# Altium project FPGYAY.PrjPcb (part 2 of 2)

## Sheet FPGA_USB.SchDoc
size A3; SheetNumber: 7; SheetTotal: 9
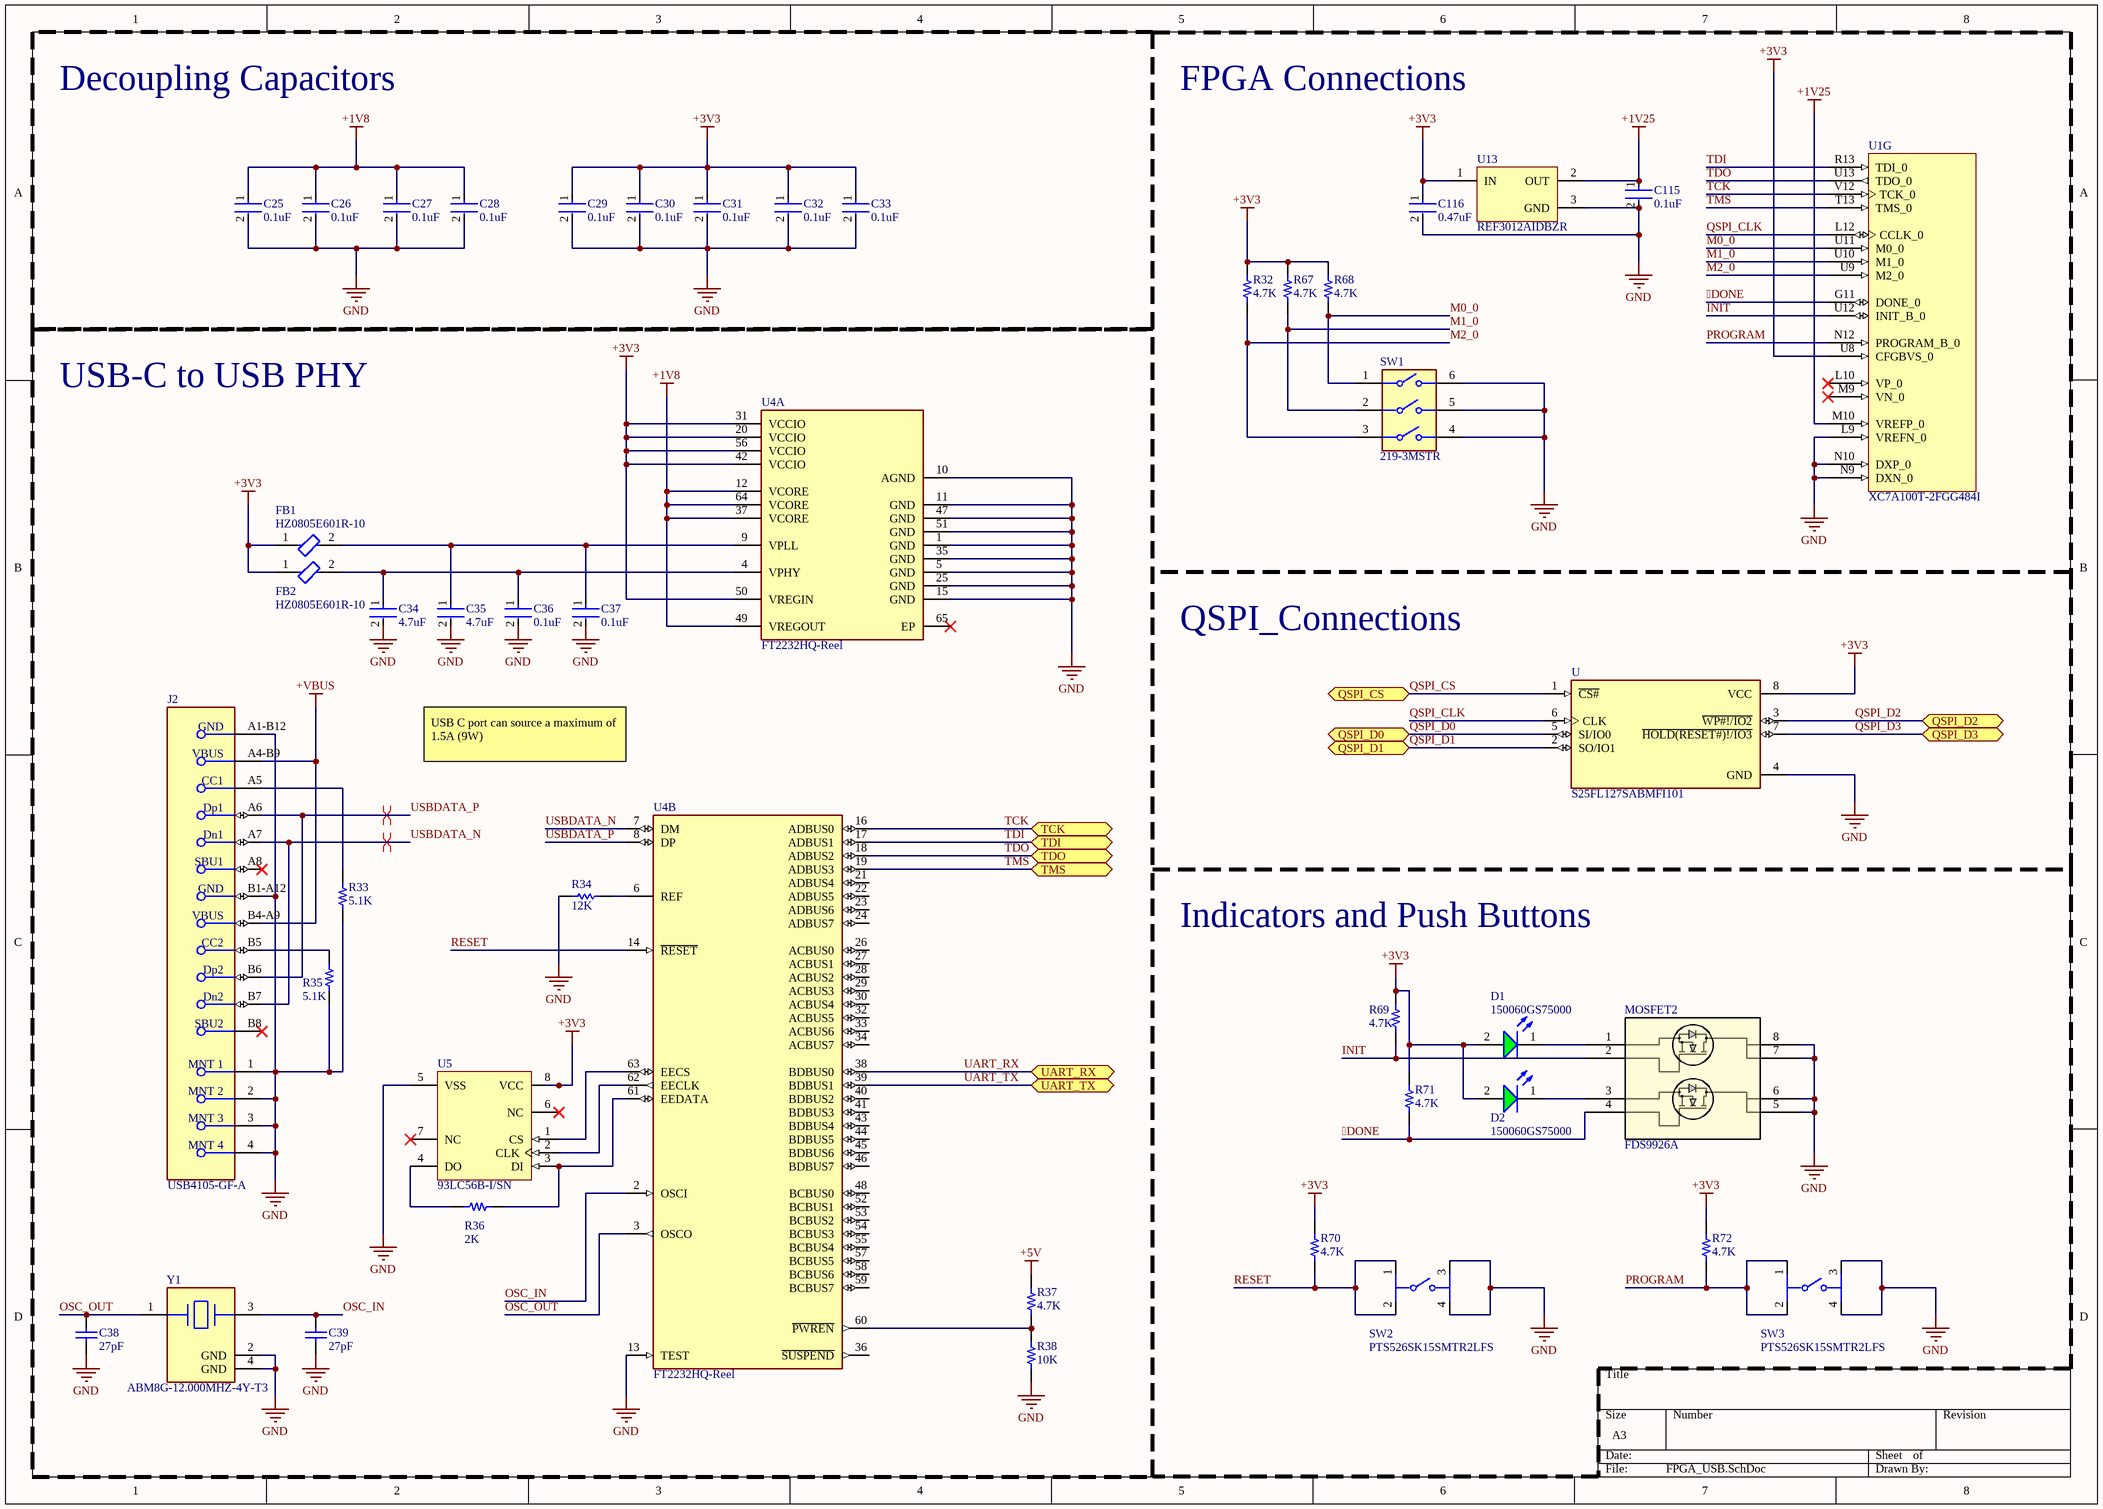
[diagram p6: FPGA_USB.SchDoc]

### Parts
C25  0.1uF  [FP-CC0402-MFG]
C26  0.1uF  [FP-CC0402-MFG]
C27  0.1uF  [FP-CC0402-MFG]
C28  0.1uF  [FP-CC0402-MFG]
C29  0.1uF  [FP-CC0402-MFG]
C30  0.1uF  [FP-CC0402-MFG]
C31  0.1uF  [FP-CC0402-MFG]
C32  0.1uF  [FP-CC0402-MFG]
C33  0.1uF  [FP-CC0402-MFG]
C34  4.7uF  [FP-CC0402-MFG]
C35  4.7uF  [FP-CC0402-MFG]
C36  0.1uF  [FP-CC0402-MFG]
C37  0.1uF  [FP-CC0402-MFG]
C38  27pF  [CAPC1005X55X25LL05T10]
C39  27pF  [CAPC1005X55X25LL05T10]
C115  0.1uF  [FP-CC0402-MFG]
C116  0.47uF  [FP-GRM188-0_1-e0_2_0_5-MFG]
D1  150060GS75000  [WL-SMCW_0603_150060xx75000]
D2  150060GS75000  [WL-SMCW_0603_150060xx75000]
FB1  HZ0805E601R-10  [FP-HZ0805-MFG]
FB2  HZ0805E601R-10  [FP-HZ0805-MFG]
J2  USB4105-GF-A  [FP-USB4105-GF-A-MFG]
MOSFET2  FDS9926A  [SOIC8_751EB_ONS-M]
R32  4.7K  [RES 0603_1608]
R33  5.1K  [RES 0603_1608]
R34  12K  [RESC1608X55X25NL10T15]
R35  5.1K  [RES 0603_1608]
R36  2K  [RES 0603_1608]
R37  4.7K  [RES 0603_1608]
R38  10K  [RES 0603_1608]
R67  4.7K  [RES 0603_1608]
R68  4.7K  [RES 0603_1608]
R69  4.7K  [RES 0603_1608]
R70  4.7K  [RES 0603_1608]
R71  4.7K  [RES 0603_1608]
R72  4.7K  [RES 0603_1608]
SW1  219-3MSTR  [FP-219-3MSTR-MFG]
SW2  PTS526SK15SMTR2LFS  [FP-PTS526SK15SMTR2LFS-MFG]
SW3  PTS526SK15SMTR2LFS  [FP-PTS526SK15SMTR2LFS-MFG]
U  S25FL127SABMFI101  [SOIC127P800X216-8N]
U1  XC7A100T-2FGG484I  [FGG484]  (part G of 10)
U4  FT2232HQ-Reel  [FP-FT2232HQ-Reel-MFG]  (parts A,B of 2)
U5  93LC56B-I/SN  [SOIC-SN8_L]
U13  REF3012AIDBZR  [DBZ0003A_M]
Y1  ABM8G-12.000MHZ-4Y-T3  [FP-ABM8G-MFG]

### Blocks framed on the sheet
Decoupling Capacitors: C25-C33
USB-C to USB PHY: C34-C39 FB1 FB2 J2 R33-R38 U4 U5 Y1

### Ports
QSPI_CS (bidir), QSPI_D0 (bidir), QSPI_D1 (bidir), QSPI_D2 (bidir), QSPI_D3 (bidir), TCK (bidir), TDI (bidir), TDO (bidir), TMS (bidir), UART_RX (bidir), UART_TX (bidir)

### Nets
+1V8: C25.1 C26.1 C27.1 C28.1 U4.12(VCORE) U4.37(VCORE) U4.49(VREGOUT) U4.64(VCORE)
+1V25: C115.1 U1.M10(VREFP_0) U13.2(OUT)
+3V3: C29.1 C30.1 C31.1 C32.1 C33.1 C116.1 D1.2(A) D2.2(A) FB1.1 FB2.1 R32.2 R67.1 R68.1 R69.1 R70.1 R71.1 R72.1 U.8(VCC) U1.U8(CFGBVS_0) U4.20(VCCIO) U4.31(VCCIO) U4.42(VCCIO) U4.50(VREGIN) U4.56(VCCIO) U5.8(VCC) U13.1(IN)
+5V: R37.1
+VBUS: J2.A4-B9(VBUS) J2.B4-A9(VBUS)
GND: C25.2 C26.2 C27.2 C28.2 C29.2 C30.2 C31.2 C32.2 C33.2 C34.2 C35.2 C36.2 C37.2 C38.2 C39.2 C115.2 C116.2 J2.1(MNT_1) J2.2(MNT_2) J2.3(MNT_3) J2.4(MNT_4) J2.A1-B12(GND) J2.B1-A12(GND) MOSFET2.5 MOSFET2.6 MOSFET2.7 MOSFET2.8 R33.2 R34.1 R35.2 R38.2 SW1.4 SW1.5 SW1.6 SW2.3 SW2.4 SW3.3 SW3.4 U.4(GND) U1.L9(VREFN_0) U1.N9(DXN_0) U1.N10(DXP_0) U4.1(GND) U4.5(GND) U4.10(AGND) U4.11(GND) U4.13(TEST) U4.15(GND) U4.25(GND) U4.35(GND) U4.47(GND) U4.51(GND) U5.5(VSS) U13.3(GND) Y1.2(GND) Y1.4(GND)
DONE: MOSFET2.4 R71.2 U1.G11(DONE_0)
\: J2.A6(Dp1) J2.B6(Dp2) U4.8(DP)  [also labelled USBDATA_P]
INIT: MOSFET2.2 R69.2 U1.U12(INIT_B_0)
M0_0: R68.2 SW1.1 U1.U11(M0_0)
M1_0: R67.2 SW1.2 U1.U10(M1_0)
M2_0: R32.1 SW1.3 U1.U9(M2_0)
OSC_IN: C39.1 U4.2(OSCI) Y1.3
OSC_OUT: C38.1 U4.3(OSCO) Y1.1
PROGRAM: R72.2 SW3.1 SW3.2 U1.N12(PROGRAM_B_0)
QSPI_CLK: U.6(CLK) U1.L12(CCLK_0)
QSPI_CS: U.1(~{CS#}) ; port QSPI_CS
QSPI_D0: U.5(SI/IO0) ; port QSPI_D0
QSPI_D1: U.2(SO/IO1) ; port QSPI_D1
QSPI_D2: U.3(~{WP#!/IO2}) ; port QSPI_D2
QSPI_D3: U.7(~{HOLD(RESET#)!/IO3}) ; port QSPI_D3
RESET: R70.2 SW2.1 SW2.2 U4.14(~{RESET})
TCK: U1.V12(TCK_0) U4.16(ADBUS0) ; port TCK
TDI: U1.R13(TDI_0) U4.17(ADBUS1) ; port TDI
TDO: U1.U13(TDO_0) U4.18(ADBUS2) ; port TDO
TMS: U1.T13(TMS_0) U4.19(ADBUS3) ; port TMS
UART_RX: U4.38(BDBUS0) ; port UART_RX
UART_TX: U4.39(BDBUS1) ; port UART_TX
USBDATA_N: J2.A7(Dn1) J2.B7(Dn2) U4.7(DM)
NetC34_1: C34.1 C36.1 FB2.2 U4.4(VPHY)
NetC35_1: C35.1 C37.1 FB1.2 U4.9(VPLL)
NetD1_1: D1.1(K) MOSFET2.1
NetD2_1: D2.1(K) MOSFET2.3
NetJ2_A5: J2.A5(CC1) R33.1
NetJ2_B5: J2.B5(CC2) R35.1
NetR34_2: R34.2 U4.6(REF)
NetR36_1: R36.1 U5.4(DO)
NetR36_2: R36.2 U4.61(EEDATA) U5.3(DI)
NetR37_2: R37.2 R38.1 U4.60(~{PWREN})
NetU4_62: U4.62(EECLK) U5.2(CLK)
NetU4_63: U4.63(EECS) U5.1(CS)

Not connected (* = marked no-connect by the designer): J2 A8(SBU1)* B8(SBU2)*; U1 L10(VP_0)* M9(VN_0)*; U4 21(ADBUS4) 22(ADBUS5) 23(ADBUS6) 24(ADBUS7) 26(ACBUS0) 27(ACBUS1) 28(ACBUS2) 29(ACBUS3) 30(ACBUS4) 32(ACBUS5) 33(ACBUS6) 34(ACBUS7) 36(~{SUSPEND}) 40(BDBUS2) 41(BDBUS3) 43(BDBUS4) 44(BDBUS5) 45(BDBUS6) 46(BDBUS7) 48(BCBUS0) 52(BCBUS1) 53(BCBUS2) 54(BCBUS3) 55(BCBUS4) 57(BCBUS5) 58(BCBUS6) 59(BCBUS7) 65(EP)*; U5 6(NC)* 7(NC)*

### Layout directives
differential pair: \, USBDATA_N

### Notes on the sheet
- FPGA Connections
- QSPI_Connections
- USB C port can source a maximum of 1.5A (9W)
- Indicators and Push Buttons

### Library data of the parts
C25-C33 C36 C37 C115 = CMP-03422-000048-1: as C21 on sheet FPGA_ETH; Device Class L1: Passive Components; Temperature Range Low: -55°C; Device Class L3: Ceramic Capacitors; Temperature Characteristic: X7R; Ipc Land Pattern Name: CAPC10050X50; Temperature Range High: +125°C; Voltage Rating: 16 V; Temperature: -55°C to +125°C; RoHS: TRUE; Automotive: No; Height: 0.55mm; Device Class L2: Capacitors; Digikey Description: CAP CER 0.1UF 16V X7R 0402; Package: CC0402; Footprint Url: http://www.yageo.com/exep/pages/download/literatures/UPY-C_GEN_24.pdf; ComponentLink2Description: Datasheet; Category: Cap; Lead Free: Yes; Octopart: https://octopart.com/cc0402krx7r7bb104-yageo-42244624; ComponentLink2URL: http://www.yageo.com/documents/recent/UPY-GP_NP0_16V-to-50V_16.pdf; Mouser Description: 0402 0.1 uF 16 V ±10 % Tolerance X7R SMT Multilayer Ceramic Capacitor
C34 C35 = CMP-03422-001118-1: CAP CER 4.7UF 10V X5R 0402; Manufacturer Part Number: CC0402MRX5R6BB475; Manufacturer: YAGEO; Automotive Grade: NA; Tolerance: 0.2; Temperature Coefficient: 30ppm/°C; Material: Ceramic; ComponentLink2URL: http://www.yageo.com/documents/recent/UPY-GP_NP0_16V-to-50V_16.pdf; Temperature Range Low: -55°C; Digikey Description: CAP CER 4.7UF 10V X5R 0402; Category: Cap; Height: 0.55mm; Mouser Description: Multilayer Ceramic Capacitors MLCC - SMD/SMT 4.7M nF X5R 20% 10 Volts; ComponentLink2Description: Datasheet; Automotive: No; Octopart: https://octopart.com/cc0402mrx5r6bb475-yageo-57080755; Device Class L3: Ceramic Capacitors; Temperature Characteristic: X5R; Ipc Land Pattern Name: CAPC10050X50; Device Class L1: Passive Components; RoHS: TRUE; Device Class L2: Capacitors; Temperature Range High: +125°C; Voltage Rating: 10 V; Value: 4.7 uF; Footprint Url: http://www.yageo.com/exep/pages/download/literatures/UPY-C_GEN_24.pdf; Capacitance: 4.7 uF; Package: CC0402; Lead Free: Yes; Temperature: -55°C to +125°C
C38 C39 = CMP-2008-03917-1: Part Number: GRM1555C1H270JA01D; Manufacturer: Murata
C116 = CMP-06035-003857-1: Chip Multilayer Ceramic Capacitors for General Purpose, 0603, 0.47uF, X7R, 15%, 10%, 25V; Capacitance: 470nF; Voltage: 50V; Case Code (Imperial): 0603; Mount: Surface Mount; Material: Ceramic; Case/Package: 0603; Thickness: 0.035inch; Tolerance: 10%; Length: 1.6mm; Lead Free: Lead Free; Voltage Rating: 25V; Width: 0.031inch; Voltage Rating (DC): 25V; Dielectric: X7R; Case Code (Metric): 1608; Number of Pins: 2; Termination: SMD/SMT; REACH SVHC: No SVHC; Min Operating Temperature: -55°C; Max Operating Temperature: 125°C; Depth: 0.8mm; Height: 0.8mm; Package Quantity: 4000; Packaging: Tape and Reel
D1 D2 = CMP-1426-00002-3: NexarPartId: 29687084; Color: Green; Power Dissipation: 105mW; Peak Wavelength: 515nm; Viewing Angle: 140°; Test Current: 20mA; Wavelength: 520nm; Lens Style: Clear, Rectangular; Max Junction Temperature (Tj): 95°C; Luminous Intensity: 430mcd; Output Current: 10µA; Max Reverse Voltage (DC): 5V; Forward Voltage: 3.2V; Dominant Wavelength: 525nm; Forward Current: 100mA; Mount: Surface Mount; Height: 700µm; Lead Free: Lead Free; Min Operating Temperature: -40°C; Max Operating Temperature: 85°C; Length: 1.6mm; Width: 800µm; Case/Package: 0603; Case Code (Imperial): 0603; Case Code (Metric): 1608; Packaging: Tape and Reel; Reverse Voltage: 5V; REACH SVHC: Unknown; RoHS: Compliant
FB1 FB2 = CMP-2000-05194-2: FERRITE BEAD 600 OHM 0805 1LN; Current Rating: 500mA; Frequency: 100MHz; DC Resistance (DCR): 300mR; Number of Lines: 1; Impedance: 600R; Packaging: Tape and Reel; Mount: Surface Mount; Package Quantity: 1; Material: Ferrite; Width: 0.049inch; Min Operating Temperature: -40°C; Core Material: Ferrite; Max Current Rating: 500mA; Case Code (Metric): 2012; Depth: 1.45mm; Case Code (Imperial): 0805; Termination: SMD/SMT; Contact Plating: Tin; Lead Free: Lead Free; Weight: 0.00392oz; Case/Package: 0805; Test Frequency: 100MHz; Length: 2mm; Height: 1.25mm; Max Operating Temperature: 125°C; Max DC Current: 500mA
J2 = CMP-245163-000001-1: CONN RCPT USB2.0 TYPEC 5A; Manufacturer: GCT; Voltage Rating: 20V; Is Female: yes; Current Rating: 5/6.25/1.25/0.25A; Number Of Contacts: 16; Conn Orientation: Right Angle; Device Class L1: Connectors; Category: Conn; Lead Free: Yes; RoHS: TRUE; Temperature Range High: +85°C; Digikey Description: CONN RCPT USB2.0 TYPEC 5A; Device Class L3: unset; ComponentLink2Description: Datasheet; Manufacturer Part Number: USB4105-GF-A; Package: 0; Usb Standard: USB 2.0; Device Class L2: USB Connectors; Automotive: No; Temperature Range Low: -40°C; Height: 3.46mm; Temperature: -40°C to +85°C; Contact Material: Gold,Nickel; ComponentLink2URL: https://gct.co/files/drawings/usb4105.pdf; Octopart: https://octopart.com/usb4105-gf-a-gct-106627878
MOSFET2 = FDS9926A: No Description Available; Mfr_Name: onsemi; RefDes: RefDes; Type: Type
R32 R37 R67-R72 = CMP-010-0075-8: as R73 on sheet FPGA_OUTPUTS; Case/Package: 0603; Voltage Rating: 75V
R33 R35 = CMP-00051-2: 5.1 kOhms ±1% 0.1W, 1/10W Chip Resistor 0603 (1608 Metric) Automotive AEC-Q200 Thick Film; Voltage Rating: 75V; Temperature Coefficient: 100ppm/°C; Case/Package: 0603
R34 = CMP-1659-00047-2: Chip Resistor, 12 KOhm, +/- 1%, 100 mW, -55 to 155 degC, 0603 (1608 Metric), RoHS, Tape and Reel; Resistance: 12 kohm; Power Rating: 100 mW; Voltage Rating (DC): 50 V; Case\Package: 0603; ComponentLink2URL: http://www.yageo.com/documents/recent/PYu-RC_Group_51_RoHS_L_04.pdf; Case Code (Imperial): 0603; ComponentLink2Description: Datasheet; Height: 0.45 mm; Case Code (Metric): 1608; RoHSCompliant: true; Max Operating Temperature: 155 degC; Width: 0.8 mm; Mount: Surface Mount; ComponentLink1URL: http://www.yageo.com/; Pins: 2; Tolerance: 1%; Min Operating Temperature: -55 degC; Length: 1.6 mm; PackageReference: 0603; REACH SVHC: No SVHC; PackageDescription: 2-Pin Surface Mount Device, Body 1.6 x 0.8 mm; Voltage Rating: 50 V; Packaging: Tape and Reel; Package Quantity: 5000; ComponentLink1Description: Manufacturer URL; DatasheetVersion: Rev. 4, 02/2016
R36 = CMP-010-0057-8: 2k Ohm ±1% 0.1W, 1/10W Chip Resistor 0603 (1608 Metric) Moisture Resistant Thick Film; Voltage Rating: 75V; Temperature Coefficient: 100ppm/°C; Case/Package: 0603
R38 = CMP-009-00190-14: 10 ±1% 0.1W, 1/10W Chip Resistor 0603 (1608 Metric) Automotive AEC-Q200 Thick Film; Voltage Rating: 75V; Temperature Coefficient: 100ppm/°C; Case/Package: 0603
SW1 = CMP-07018-000004-1: SWITCH SLIDE DIP SPST 100MA 20V; Washable: Yes; Mechanical Life: 2000Cycles; Number of Positions: 3; Pitch: 0.1inch; Actuator Type: Slide (Standard); Max Operating Temperature: 85°C; Voltage Rating (DC): 20V; Termination: Gull Wing; Length: 0.358inch; Min Operating Temperature: -55°C; Orientation: Straight; Mount: Surface Mount; Package Quantity: 1000; Current Rating: 100mA; Electrical Life: 2000Cycles; Max Current Rating: 100mA; Throw Configuration: SPST; Contact Material: Copper; Packaging: Tape and Reel; Contact Plating: Gold; Lead Free: Lead Free; Max Voltage Rating (DC): 20V
SW2 SW3 = CMP-10040-000013-1: TACT 5.2 X 5.2, 1.5 MM H, 260GF,; Manufacturer: C&K; Operating Force: 250gf; Throw Configuration: SPST-NO; Contact Current Rating: 50mA; Standoff Height: 0mm; Contact Resistance: 100mΩ; Voltage Rating Dc: 12V; Electromechanical Life: 200000Cycles; Device Class L3: Tactile Switches; Device Class L2: Switches; Temperature: -20°C to +70°C; Temperature Range Low: -20°C; Package: PTS526SK15SMTR2LFS; Temperature Range High: +70°C; ComponentLink2Description: Datasheet; Device Class L1: Electromechanical; Height: 1.65mm; Digikey Description: TACT 5.2 X 5.2, 1.5 MM H, 260GF,; Category: Switch; RoHS: TRUE; Automotive: No; Lead Free: Yes; Manufacturer Part Number: PTS526SK15SMTR2LFS; Octopart: https://octopart.com/pts526+sk15+smtr2+lfs-c%26k+components-100617999; ComponentLink2URL: https://www.ckswitches.com/media/2780/pts526.pdf
U = S25FL127SABMFI101: FLASH - NOR Memory IC 128Mb _16M x 8_ SPI - Quad I/O 108MHz 8-SOIC; MF: Cypress Semiconductor; SnapEDA_Link: https://www.snapeda.com/parts/S25FL127SABMFI101/Teledyne%20e2v/view-part/580625/?ref=snap; Value: *; Digi-Key_Part_Number: 1274-1045-ND; Digi-Key_Purchase_URL: https://www.digikey.com/product-detail/en/cypress-semiconductor-corp/S25FL127SABMFI101/1274-1045-ND/4142071?utm_source=snapeda&utm_medium=aggregator&utm_campaign=symbol; MP: S25FL127SABMFI101; Package: SOIC-8 Cypress Semiconductor
U1 = CMP-0364-00030-3: as U1 on sheet Sheet1; ComponentLink2URL: http://www.xilinx.com/support/documentation/user_guides/ug475_7Series_Pkg_Pinout.pdf; DatasheetVersion: v1.12; PartNumber: XC7A100T-2FGG484I; ComponentLink5Description: Packaging and Pinout; PackageDescription: Wire-Bond Fine-Pitch BGA, Body 23 x 23 mm, 1.0 mm Pitch; Mounting Technology: Surface Mount; ComponentLink1Description: Datasheet; ComponentLink4URL: http://www.xilinx.com/support/packagefiles/a7packages/xc7a100tfgg484pkg.txt; PackageVersion: Rev 1.8; NexusDeviceID: XC7A100T-2FGG484I; ComponentLink5URL: http://www.xilinx.com/support/documentation/user_guides/ug475_7Series_Pkg_Pinout.pdf; Code_JEDEC: MS-034-AAJ-1; Generic Part Number: XC7A100T; ComponentLink4Description: Package File; ComponentLink3Description: DC and Switching Characteristics; ComponentLink1URL: http://www.xilinx.com/support/documentation/data_sheets/ds180_7Series_Overview.pdf; CLBs (Max Distributed RAM Kb): 1188; ComponentLink2Description: Package Specification; RoHS: Pb-Free; ComponentLink3URL: http://www.xilinx.com/support/documentation/data_sheets/ds181_Artix_7_Data_Sheet.pdf; PackageReference: FGG484
U4 = CMP-0078-00004-5: IC USB HS DUAL UART/FIFO 64-QFN; Manufacturer: FTDI; Min Supply Voltage: 1.62V; Ciiva Ids: 1315829; Nominal Supply Current: 5-70mA; Standoff Height: 0mm; Import Ts: 1521843541; Description: USB Bridge, USB to UART,FIFO USB 2.0 UART Interface 64-QFN (9x9); Number Of Ports: 1; Max Supply Voltage: 3.63V; Data Rate: 480Mbits/s; Interface: I2C,SPI,UART,USB,RS-232,RS-485,RS-422,Other; Usb Standard: USB 2.0; Octopart: https://octopart.com/ft2232hq-reel-ftdi-19172126; Ipc Land Pattern Name: QFN50P900X900X85-64; Ambient Temperature Range High: +85°C; RoHS: TRUE; Manufacturer Part Number: FT2232HQ-Reel; Automotive: No; Footprint Url: https://www.ftdichip.com/Support/Documents/TechnicalNotes/TN_166%20FTDI%20Example%20IC%20PCB%20Footprints.pdf; Temperature Range High: +85°C; ComponentLink2Description: Datasheet; Ambient Temperature Range Low: -40°C; Mouser Description: USB Interface IC USB HS to Dual UART/ FIFO/SPI/JTAG/I2C; ComponentLink2URL: https://www.ftdichip.com/Support/Documents/DataSheets/ICs/DS_FT2232H.pdf; Digikey Description: IC USB HS DUAL UART/FIFO 64-QFN; Release Date: 1383921489; Height: 0.9mm; Lead Free: Yes; Package: QFN64; Device Class L1: Integrated Circuits (ICs); Temperature: -40°C to +85°C; Temperature Range Low: -40°C; Category: IC; Device Class L2: Interface ICs; Device Class L3: USB Interface ICs
U5 = CMP-0162-00077-1: 2K, 128x16-bit, 2.5V Microwire Serial EEPROM, 8-Pin SOIC 150mil, Industrial Temperature; Code_IPC: SOIC127P600-8; PackageVersion: revBB, Aug-2009; PackageDescription: 8-Lead Plastic Small Outline (SN) - Narrow, 3.90mm Body [SOIC]; DatasheetVersion: revF, May-2008; PackageReference: SOIC-SN8; Code_JEDEC: MS-012
U13 = CMP-0367-00192-2: 1.25 V, 50 ppm / degC, 50 uA Series (Bandgap) Voltage Reference, -40 to 125 degC, 3-pin SOT-23 (DBZ), Green (RoHS & no Sb/Br); Manufacturer: Texas Instruments; VI(Min)(V): 1.8; Iq(Max)(uA): 50; Rating: Catalog; Temp Coeff(Typ)(ppm/ degree C): 20; VI(Max)(V): 5.5; SubFamily: Series Voltage Reference; VO(V): 1.25; Initial Accuracy @ 25/deg C(%): 0.2; Mounting Technology: Surface Mount; PackageDescription: 3-Pin Plastic Small Outline, Body 2.92 x 1.3 mm, Pitch 0.95 mm; PartNumber: REF3012AIDBZR; ComponentLink3Description: Package Specification; Temp Coeff(Max)(ppm/ degree C): 50; ComponentLink1URL: http://www.ti.com/; PackageVersion: 4203227/B; ComponentLink3URL: http://www.ti.com/litv/pdf/mpds108a; ComponentLink2URL: http://www.ti.com/general/docs/lit/getliterature.tsp?genericPartNumber=REF3012&fileType=pdf; Eco-Plan: Green (RoHS & no Sb/Br); ComponentLink2Description: Datasheet; Code_JEDEC: TO-236; ComponentLink1Description: Manufacturer URL; PackageReference: DBZ0003A; DatasheetVersion: SBVS032F
Y1 = CMP-27762-014577-1: Crystal 12MHz ±30ppm (Tol) ±30ppm (Stability) 10pF FUND 120Ω 4-Pin SMD T/R; ESR (Equivalent Series Resistance): 120R; Height: 0.039inch; Load Capacitance: 10pF; Operating Frequency: 12 MHz; REACH SVHC: No SVHC; Series: ABM8G; Series Resistance: 120R; Width: 0.098inch; Case/Package: CSMD; Min Operating Temperature: -10°C; Frequency: 12MHz; Mount: Surface Mount; Frequency Tolerance: 30ppm; Max Operating Temperature: 60°C; Lead Free: Lead Free; Frequency Stability: 30ppm; Depth: 2.5mm; Number of Pins: 4; Length: 3.2mm; Packaging: Tape and Reel

## Sheet FPGA_AUDIO.SchDoc
size A4; SheetNumber: 7; SheetTotal: 8
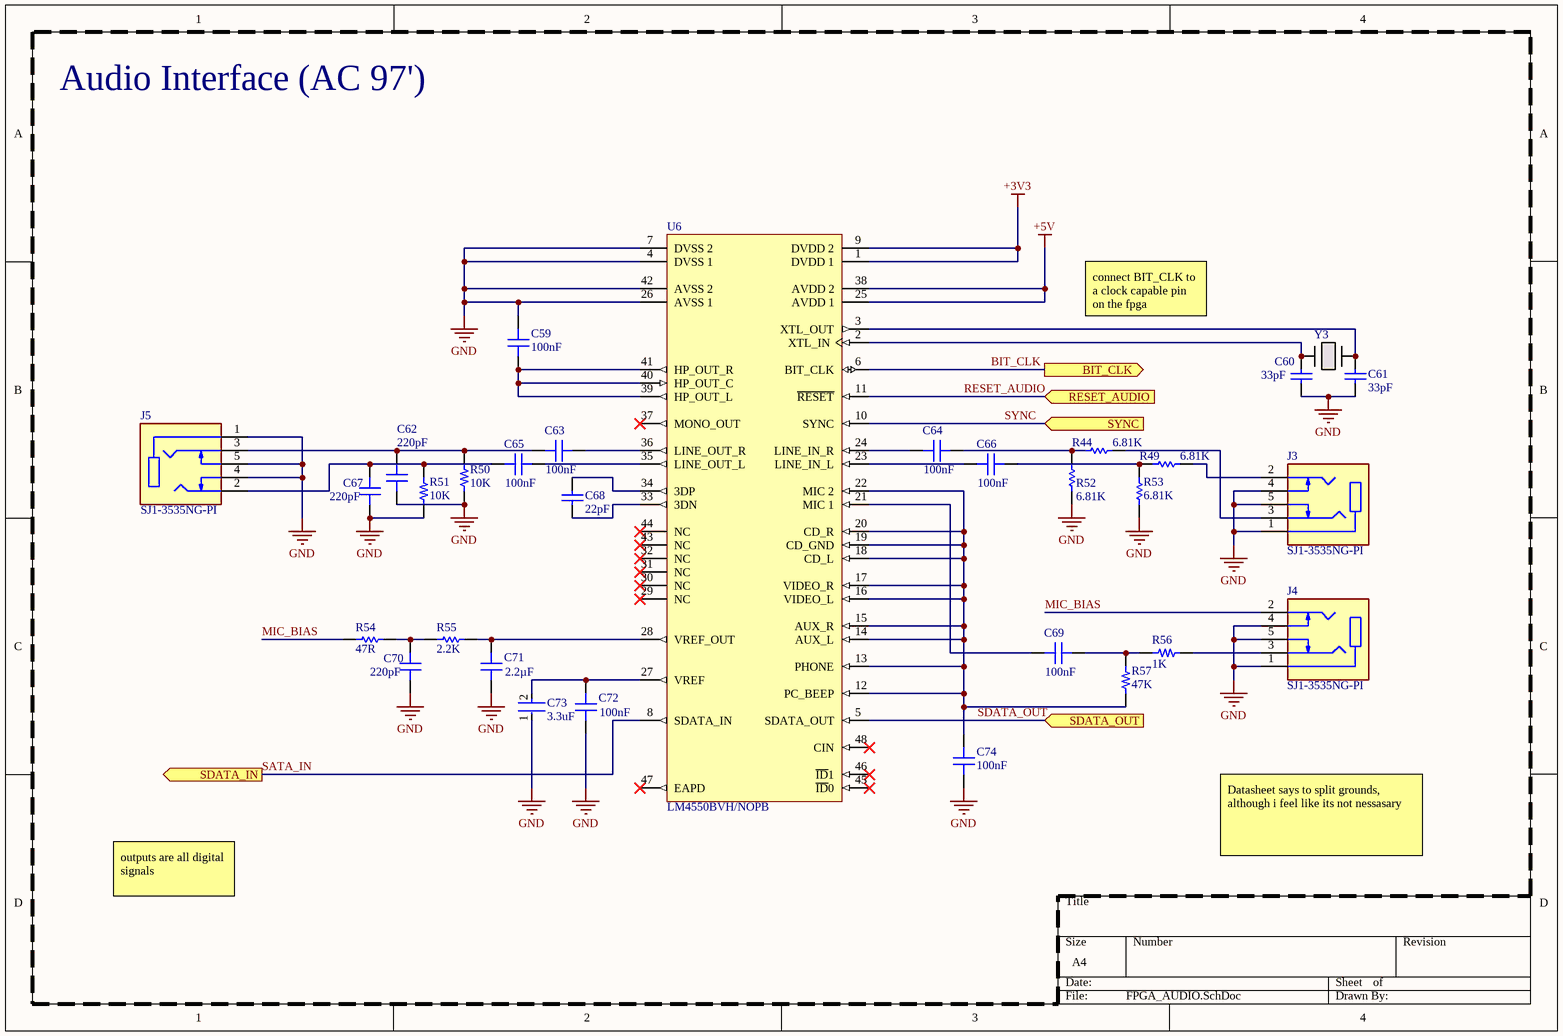
[diagram p7: FPGA_AUDIO.SchDoc]

### Parts
C59  Capacitance: 100nF  [CAP 0603_1608]  (hidden comment: CAP CER 0.1UF 100V 10% X7R 0603)
C60  33pF  [CAPC1005X55X25ML05T10]
C61  33pF  [CAPC1005X55X25ML05T10]
C62  Capacitance: 220pF  [CAP 0603_1608]  (hidden comment: CAP CER 220PF 50V 5% C0G/NP0 0603)
C63  Capacitance: 100nF  [CAP 0603_1608]  (hidden comment: CAP CER 0.1UF 100V 10% X7R 0603)
C64  Capacitance: 100nF  [CAP 0603_1608]  (hidden comment: CAP CER 0.1UF 100V 10% X7R 0603)
C65  Capacitance: 100nF  [CAP 0603_1608]  (hidden comment: CAP CER 0.1UF 100V 10% X7R 0603)
C66  Capacitance: 100nF  [CAP 0603_1608]  (hidden comment: CAP CER 0.1UF 100V 10% X7R 0603)
C67  Capacitance: 220pF  [CAP 0603_1608]  (hidden comment: CAP CER 220PF 50V 5% C0G/NP0 0603)
C68  22pF  [CAPC1005X55X25NL05T10]
C69  Capacitance: 100nF  [CAP 0603_1608]  (hidden comment: CAP CER 0.1UF 100V 10% X7R 0603)
C70  Capacitance: 220pF  [CAP 0603_1608]  (hidden comment: CAP CER 220PF 50V 5% C0G/NP0 0603)
C71  Capacitance: 2.2µF  [CAP 0603_1608]  (hidden comment: CAP CER 2.2UF 25V 10% X5R 0603)
C72  Capacitance: 100nF  [CAP 0603_1608]  (hidden comment: CAP CER 0.1UF 100V 10% X7R 0603)
C73  3.3uF  [FP-C1608-080-0_1-IPC_C]
C74  Capacitance: 100nF  [CAP 0603_1608]  (hidden comment: CAP CER 0.1UF 100V 10% X7R 0603)
J3  SJ1-3535NG-PI  [CUI_SJ1-3535NG-PI]
J4  SJ1-3535NG-PI  [CUI_SJ1-3535NG-PI]
J5  SJ1-3535NG-PI  [CUI_SJ1-3535NG-PI]
R44  6.81K  [RESC1005X40X25ML05T05]
R49  6.81K  [RESC1005X40X25ML05T05]
R50  10K  [RES 0603_1608]
R51  10K  [RES 0603_1608]
R52  6.81K  [RESC1005X40X25ML05T05]
R53  6.81K  [RESC1005X40X25ML05T05]
R54  47R  [RESC1608X55X30NL15T15]
R55  2.2K  [RESC1608X55X25LL10T15]
R56  1K  [RES 0603_1608]
R57  47K  [RES 0603_1608]
U6  LM4550BVH/NOPB  [PT0048A_L]
Y3  FOXSDLF245F-20  [CRYSTAL_HC49SDLF_FXT]  (value not drawn)

### Ports
BIT_CLK (out), RESET_AUDIO (in), SDATA_IN (out), SDATA_OUT (in), SYNC (in)

### Nets
+3V3: U6.1(DVDD_1) U6.9(DVDD_2)
+5V: U6.25(AVDD_1) U6.38(AVDD_2)
GND: C59.1 C60.2 C61.2 C62.2 C67.2 C70.2 C71.2 C72.2 C73.1 C74.2 J3.1 J3.4 J3.5 J4.1 J4.4 J4.5 J5.1 J5.4 J5.5 R50.2 R51.2 R52.1 R53.1 U6.4(DVSS_1) U6.7(DVSS_2) U6.26(AVSS_1) U6.42(AVSS_2)
BIT_CLK: U6.6(BIT_CLK) ; port BIT_CLK
MIC_BIAS: J4.2 R54.1
RESET_AUDIO: U6.11(~{RESET}) ; port RESET_AUDIO
SATA_IN: U6.8(SDATA_IN) ; port SDATA_IN
SDATA_OUT: U6.5(SDATA_OUT) ; port SDATA_OUT
SYNC: U6.10(SYNC) ; port SYNC
NetC59_2: C59.2 U6.39(HP_OUT_L) U6.40(HP_OUT_C) U6.41(HP_OUT_R)
NetC60_1: C60.1 U6.2(XTL_IN) Y3.2
NetC61_1: C61.1 U6.3(XTL_OUT) Y3.1
NetC62_1: C62.1 C63.1 J5.3 R50.1
NetC63_2: C63.2 U6.36(LINE_OUT_R)
NetC64_1: C64.1 U6.24(LINE_IN_R)
NetC64_2: C64.2 R44.1 R52.2
NetC65_1: C65.1 C67.1 J5.2 R51.1
NetC65_2: C65.2 U6.35(LINE_OUT_L)
NetC66_1: C66.1 U6.23(LINE_IN_L)
NetC66_2: C66.2 R49.1 R53.2
NetC68_1: C68.1 U6.34(3DP)
NetC68_2: C68.2 U6.33(3DN)
NetC69_1: C69.1 U6.21(MIC_1)
NetC69_2: C69.2 R56.1 R57.1
NetC70_1: C70.1 R54.2 R55.1
NetC71_1: C71.1 R55.2 U6.28(VREF_OUT)
NetC72_1: C72.1 C73.2 U6.27(VREF)
NetC74_1: C74.1 R57.2 U6.12(PC_BEEP) U6.13(PHONE) U6.14(AUX_L) U6.15(AUX_R) U6.16(VIDEO_L) U6.17(VIDEO_R) U6.18(CD_L) U6.19(CD_GND) U6.20(CD_R) U6.22(MIC_2)
NetJ3_2: J3.2 R49.2
NetJ3_3: J3.3 R44.2
NetJ4_3: J4.3 R56.2

Not connected (* = marked no-connect by the designer): U6 29(NC)* 30(NC)* 31(NC)* 32(NC)* 37(MONO_OUT)* 43(NC)* 44(NC)* 45(~{ID}0)* 46(~{ID}1)* 47(EAPD)* 48(CIN)*

### Notes on the sheet
- Audio Interface (AC 97')
- connect BIT_CLK to a clock capable pin on the fpga
- Datasheet says to split grounds, although i feel like its not nessasary
- outputs are all digital signals

### Library data of the parts
C59 C63-C66 C69 C72 C74 = CMP-013-0022-14: Ceramic Capacitor, Multilayer, Ceramic, 100V, 10% +Tol, 10% -Tol, X7R, 15% TC, 0.1uF, Surface Mount, 0603; Case/Package: 0603; Tolerance: 10%
C60 C61 = CMP-2008-03913-1: Part Number: GRM1555C1H330JA01D; Manufacturer: Murata
C62 C67 C70 = CMP-013-0101-6: 220pF ±5% 50V Ceramic Capacitor C0G, NP0 0603 (1608 Metric); Case/Package: 0603; Tolerance: 5%
C68 = CMP-2008-04302-1: Part Number: GRM1555C1H220JA01D; Manufacturer: Murata
C71 = CMP-013-0100-6: 2.2µF ±10% 25V Ceramic Capacitor X5R 0603 (1608 Metric); Tolerance: 10%; Case/Package: 0603
C73 = CMP-08246-004786-1: Multilayer Ceramic Capacitors 3.3μF ±10% 16V X5R SMD 0603; Max Operating Temperature: 85°C; Height: 0.8mm; Weight: 7.1E-05oz; Series: C; Construction: Flat; Capacitance: 3.3uF; Mount: Surface Mount; Voltage Rating (DC): 16V; Voltage Rating: 16V; Case Code (Imperial): 0603; Case Code (Metric): 1608; Min Operating Temperature: -55°C; Depth: 0.8mm; REACH SVHC: No SVHC; Package Quantity: 1; Case/Package: 0603; Tolerance: 10%; Packaging: Tape and Reel; Width: 0.031inch; RoHS Compliant: Yes; Thickness: 0.035inch; Lead Free: Lead Free; Length: 1.6mm; Dielectric Material: Ceramic; Radiation Hardening: No; Termination: SMD/SMT; Dielectric: X5R
J3-J5 = SJ1-3535NG-PI: 3.5 mm Right-Angle Stereo Jack, 5 pin PCB PCB Mount, Isolated Ground, Pink; Value: *; Availability: Unavailable; Price: None; Package: None; MP: SJ1-3535NG-PI
R44 R49 R52 R53 = CMP-2002-01038-1: Part Number: ERJ-2RKF6811X; Manufacturer: Panasonic
R50 R51 = CMP-009-00190-14: as R38 on sheet FPGA_USB; Case/Package: 0603
R54 = CMP-2000-00529-2: Chip Resistor, 47 Ohm, +/- 1%, 0.1 W, -55 to 155 degC, 0603 (1608 Metric), RoHS, Tape and Reel; Power Rating: 100 mW; Case\Package: 0603; Voltage Rating (DC): 50 V; Resistance: 6.8 kohm; Length: 1.6 mm; Case Code (Metric): 1608; Packaging: Tape and Reel; Min Operating Temperature: -55 degC; DatasheetVersion: Apr-15; PackageReference: 0603; Case Code (Imperial): 0603; PackageDescription: 2-Pin Surface Mount Device, Body 1.6 x 0.85 mm; Tolerance: 1%; Height: 0.45 mm; RoHSCompliant: true; ComponentLink2Description: Datasheet; Pins: 2; ComponentLink1URL: http://www.panasonic.com/; Package Quantity: 5000; REACH SVHC: No SVHC; ComponentLink2URL: http://industrial.panasonic.com/cdbs/www-data/pdf/RDA0000/AOA0000C86.pdf; Width: 0.8 mm; Mount: Surface Mount; Max Operating Temperature: 155 degC; ComponentLink1Description: Manufacturer URL; Voltage Rating: 50 V
R55 = CMP-2000-04211-1: Part Number: RC0603FR-132K2L; Manufacturer: Yageo
R56 = CMP-009-00014-17: 1 kOhms ±1% 0.1W, 1/10W Chip Resistor 0603 (1608 Metric) Moisture Resistant Thick Film; Temperature Coefficient: 100ppm/°C; Voltage Rating: 75V; Case/Package: 0603
R57 = CMP-010-0063-10: Fixed Resistor, Metal Glaze/thick Film, 0.1W, 47000ohm, 75V, 1% +/-Tol, 100ppm/Cel, Surface Mount, 0603; Temperature Coefficient: 100ppm/°C; Case/Package: 0603; Voltage Rating: 75V
U6 = CMP-0064-00035-3: AC '97 Rev 2.1 Codec with Sample Rate Conversion and National 3D Sound, 48-pin LQFP, Pb-Free; Manufacturer: Texas Instruments; PackageTopMarking: NSUZXYTT*LM4550*BVH; PowerWise: N; CompType: OtherParts; ComponentLink1Description: Datasheet URL; RoHS: Y; PackageDescription: LQFP, 7 x 7 x 1.4mm, 48 Lead, 0.5mm Pitch; PackageReference: PT0048A; PinCount: 48; ComponentLink1URL: http://www.ti.com/general/docs/lit/getliterature.tsp?genericPartNumber=LM4550B&fileType=pdf
Y3 = FOXSDLF245F-20: No Description Available; Mfr_Name: Fox

## Sheet FPGA_DDR3_Interface.SchDoc
size A3; SheetNumber: 9; SheetTotal: 9
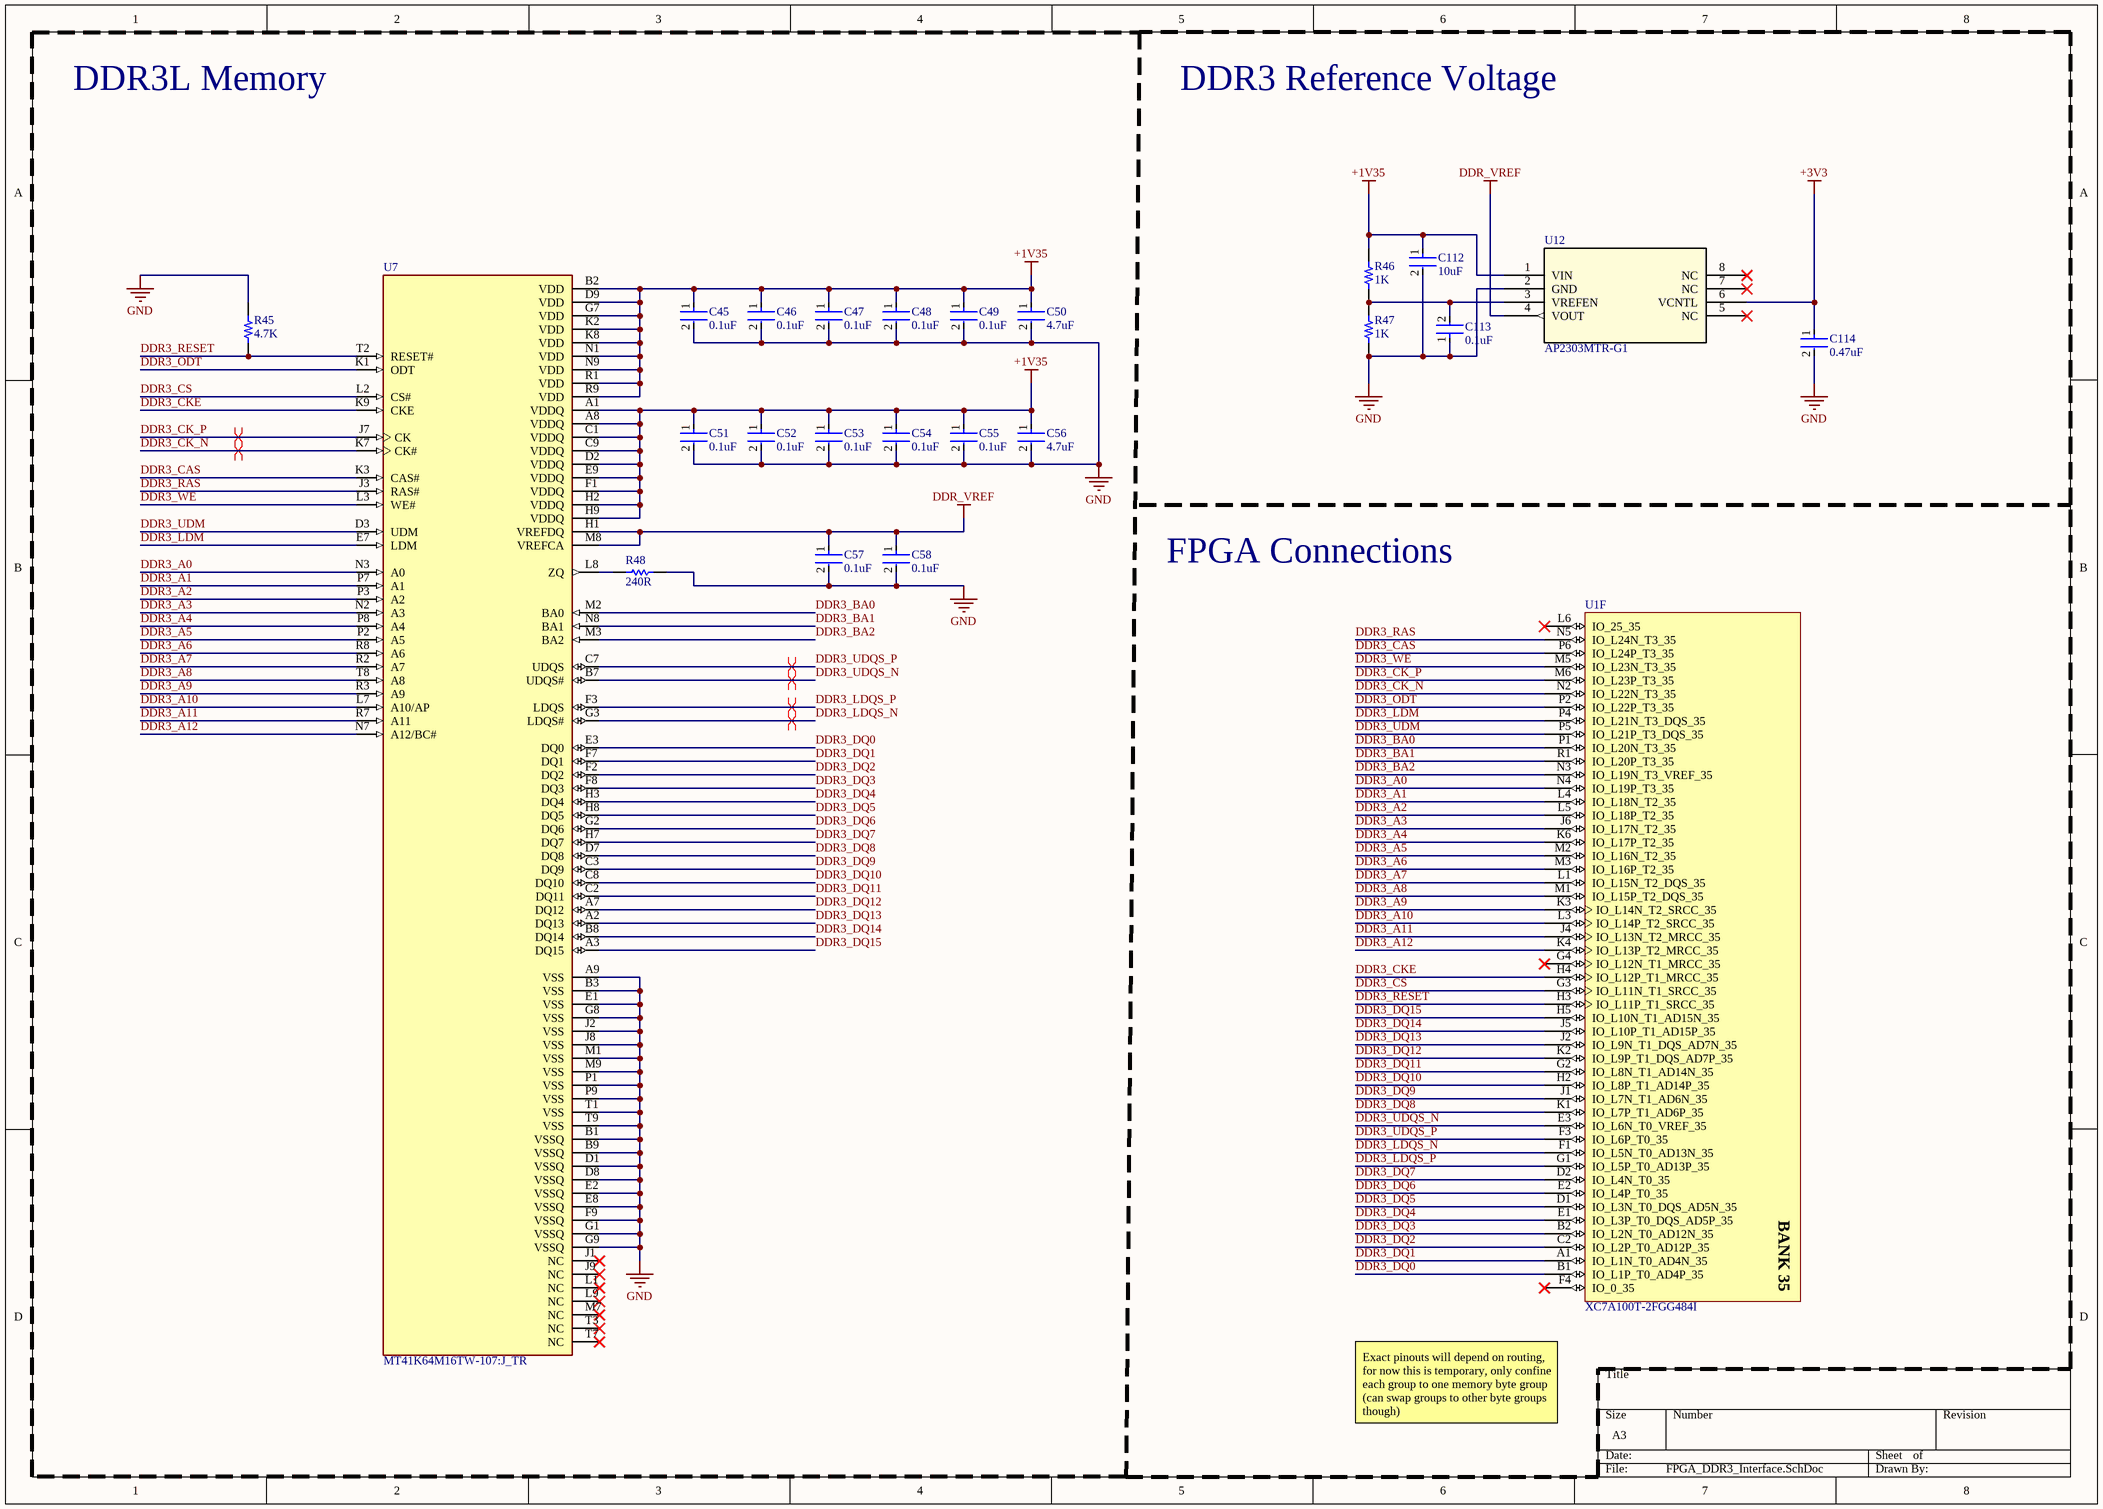
[diagram p8: FPGA_DDR3_Interface.SchDoc]

### Parts
C45  0.1uF  [FP-CC0402-MFG]
C46  0.1uF  [FP-CC0402-MFG]
C47  0.1uF  [FP-CC0402-MFG]
C48  0.1uF  [FP-CC0402-MFG]
C49  0.1uF  [FP-CC0402-MFG]
C50  4.7uF  [FP-CC0402-MFG]
C51  0.1uF  [FP-CC0402-MFG]
C52  0.1uF  [FP-CC0402-MFG]
C53  0.1uF  [FP-CC0402-MFG]
C54  0.1uF  [FP-CC0402-MFG]
C55  0.1uF  [FP-CC0402-MFG]
C56  4.7uF  [FP-CC0402-MFG]
C57  0.1uF  [FP-CC0402-MFG]
C58  0.1uF  [FP-CC0402-MFG]
C112  10uF  [FP-GRM155-0_2-IPC_C]
C113  0.1uF  [FP-CC0402-MFG]
C114  0.47uF  [FP-GRM188-0_1-e0_2_0_5-MFG]
R45  4.7K  [RES 0603_1608]
R46  1K  [RES 0603_1608]
R47  1K  [RES 0603_1608]
R48  240R  [RESC0402(1005)_L]
U1  XC7A100T-2FGG484I  [FGG484]  (part F of 10)
U7  MT41K64M16TW-107:J_TR  [BGA96C80P9X16_1400X800X120N]
U12  AP2303MTR-G1  [SOIC-8_AP2303MTR-G1_DIO-M]

### Blocks framed on the sheet
DDR3L Memory: C45-C58 R45 R48 U7

### Nets
+1V35: C45.1 C46.1 C47.1 C48.1 C49.1 C50.1 C51.1 C52.1 C53.1 C54.1 C55.1 C56.1 C112.1 R46.1 U7.A1(VDDQ) U7.A8(VDDQ) U7.B2(VDD) U7.C1(VDDQ) U7.C9(VDDQ) U7.D2(VDDQ) U7.D9(VDD) U7.E9(VDDQ) U7.F1(VDDQ) U7.G7(VDD) U7.H2(VDDQ) U7.H9(VDDQ) U7.K2(VDD) U7.K8(VDD) U7.N1(VDD) U7.N9(VDD) U7.R1(VDD) U7.R9(VDD) U12.1(VIN)
+3V3: C114.1 U12.6(VCNTL)
DDR_VREF: C57.1 C58.1 U7.H1(VREFDQ) U7.M8(VREFCA) U12.4(VOUT)
GND: C45.2 C46.2 C47.2 C48.2 C49.2 C50.2 C51.2 C52.2 C53.2 C54.2 C55.2 C56.2 C57.2 C58.2 C112.2 C113.1 C114.2 R45.2 R47.2 R48.1 U7.A9(VSS) U7.B1(VSSQ) U7.B3(VSS) U7.B9(VSSQ) U7.D1(VSSQ) U7.D8(VSSQ) U7.E1(VSS) U7.E2(VSSQ) U7.E8(VSSQ) U7.F9(VSSQ) U7.G1(VSSQ) U7.G8(VSS) U7.G9(VSSQ) U7.J2(VSS) U7.J8(VSS) U7.M1(VSS) U7.M9(VSS) U7.P1(VSS) U7.P9(VSS) U7.T1(VSS) U7.T9(VSS) U12.2(GND)
DDR3_A0: U1.N4(IO_L19P_T3_35) U7.N3(A0)
DDR3_A1: U1.L4(IO_L18N_T2_35) U7.P7(A1)
DDR3_A2: U1.L5(IO_L18P_T2_35) U7.P3(A2)
DDR3_A3: U1.J6(IO_L17N_T2_35) U7.N2(A3)
DDR3_A4: U1.K6(IO_L17P_T2_35) U7.P8(A4)
DDR3_A5: U1.M2(IO_L16N_T2_35) U7.P2(A5)
DDR3_A6: U1.M3(IO_L16P_T2_35) U7.R8(A6)
DDR3_A7: U1.L1(IO_L15N_T2_DQS_35) U7.R2(A7)
DDR3_A8: U1.M1(IO_L15P_T2_DQS_35) U7.T8(A8)
DDR3_A9: U1.K3(IO_L14N_T2_SRCC_35) U7.R3(A9)
DDR3_A10: U1.L3(IO_L14P_T2_SRCC_35) U7.L7(A10/AP)
DDR3_A11: U1.J4(IO_L13N_T2_MRCC_35) U7.R7(A11)
DDR3_A12: U1.K4(IO_L13P_T2_MRCC_35) U7.N7(A12/BC#)
DDR3_BA0: U1.P1(IO_L20N_T3_35) U7.M2(BA0)
DDR3_BA1: U1.R1(IO_L20P_T3_35) U7.N8(BA1)
DDR3_BA2: U1.N3(IO_L19N_T3_VREF_35) U7.M3(BA2)
DDR3_CAS: U1.P6(IO_L24P_T3_35) U7.K3(CAS#)
DDR3_CK_N: U1.N2(IO_L22N_T3_35) U7.K7(CK#)
DDR3_CK_P: U1.M6(IO_L23P_T3_35) U7.J7(CK)
DDR3_CKE: U1.H4(IO_L12P_T1_MRCC_35) U7.K9(CKE)
DDR3_CS: U1.G3(IO_L11N_T1_SRCC_35) U7.L2(CS#)
DDR3_DQ0: U1.B1(IO_L1P_T0_AD4P_35) U7.E3(DQ0)
DDR3_DQ1: U1.A1(IO_L1N_T0_AD4N_35) U7.F7(DQ1)
DDR3_DQ2: U1.C2(IO_L2P_T0_AD12P_35) U7.F2(DQ2)
DDR3_DQ3: U1.B2(IO_L2N_T0_AD12N_35) U7.F8(DQ3)
DDR3_DQ4: U1.E1(IO_L3P_T0_DQS_AD5P_35) U7.H3(DQ4)
DDR3_DQ5: U1.D1(IO_L3N_T0_DQS_AD5N_35) U7.H8(DQ5)
DDR3_DQ6: U1.E2(IO_L4P_T0_35) U7.G2(DQ6)
DDR3_DQ7: U1.D2(IO_L4N_T0_35) U7.H7(DQ7)
DDR3_DQ8: U1.K1(IO_L7P_T1_AD6P_35) U7.D7(DQ8)
DDR3_DQ9: U1.J1(IO_L7N_T1_AD6N_35) U7.C3(DQ9)
DDR3_DQ10: U1.H2(IO_L8P_T1_AD14P_35) U7.C8(DQ10)
DDR3_DQ11: U1.G2(IO_L8N_T1_AD14N_35) U7.C2(DQ11)
DDR3_DQ12: U1.K2(IO_L9P_T1_DQS_AD7P_35) U7.A7(DQ12)
DDR3_DQ13: U1.J2(IO_L9N_T1_DQS_AD7N_35) U7.A2(DQ13)
DDR3_DQ14: U1.J5(IO_L10P_T1_AD15P_35) U7.B8(DQ14)
DDR3_DQ15: U1.H5(IO_L10N_T1_AD15N_35) U7.A3(DQ15)
DDR3_LDM: U1.P4(IO_L21N_T3_DQS_35) U7.E7(LDM)
DDR3_LDQS_N: U1.F1(IO_L5N_T0_AD13N_35) U7.G3(LDQS#)
DDR3_LDQS_P: U1.G1(IO_L5P_T0_AD13P_35) U7.F3(LDQS)
DDR3_ODT: U1.P2(IO_L22P_T3_35) U7.K1(ODT)
DDR3_RAS: U1.N5(IO_L24N_T3_35) U7.J3(RAS#)
DDR3_RESET: R45.1 U1.H3(IO_L11P_T1_SRCC_35) U7.T2(RESET#)
DDR3_UDM: U1.P5(IO_L21P_T3_DQS_35) U7.D3(UDM)
DDR3_UDQS_N: U1.E3(IO_L6N_T0_VREF_35) U7.B7(UDQS#)
DDR3_UDQS_P: U1.F3(IO_L6P_T0_35) U7.C7(UDQS)
DDR3_WE: U1.M5(IO_L23N_T3_35) U7.L3(WE#)
NetC113_2: C113.2 R46.2 R47.1 U12.3(VREFEN)
NetR48_2: R48.2 U7.L8(ZQ)

Not connected (* = marked no-connect by the designer): U1 F4(IO_0_35)* G4(IO_L12N_T1_MRCC_35)* L6(IO_25_35)*; U7 J1(NC)* J9(NC)* L1(NC)* L9(NC)* M7(NC)* T3(NC)* T7(NC)*; U12 5(NC)* 7(NC)* 8(NC)*

### Layout directives
differential pair: DDR3_CK_N, DDR3_CK_P, DDR3_LDQS_N, DDR3_LDQS_P, DDR3_UDQS_N, DDR3_UDQS_P

### Notes on the sheet
- DDR3 Reference Voltage
- FPGA Connections
- Exact pinouts will depend on routing, for now this is temporary, only confine each group to one memory byte group (can swap groups to other byte groups though)
- (in symbol CMP-0364-00030-3, part F) BANK 35

### Library data of the parts
C45-C49 C51-C55 C57 C58 C113 = CMP-03422-000048-1: CAP CER 0.1UF 16V X7R 0402; Manufacturer: YAGEO; Manufacturer Part Number: CC0402KRX7R7BB104; Material: Ceramic; Automotive Grade: NA; Capacitance: 100 nF; Temperature Coefficient: 30ppm/°C; Tolerance: 0.1; Value: 100 nF; Device Class L1: Passive Components; Temperature Range Low: -55°C; Device Class L3: Ceramic Capacitors; Temperature Characteristic: X7R; Ipc Land Pattern Name: CAPC10050X50; Temperature Range High: +125°C; Voltage Rating: 16 V; Temperature: -55°C to +125°C; RoHS: TRUE; Automotive: No; Height: 0.55mm; Device Class L2: Capacitors; Digikey Description: CAP CER 0.1UF 16V X7R 0402; Package: CC0402; Footprint Url: http://www.yageo.com/exep/pages/download/literatures/UPY-C_GEN_24.pdf; ComponentLink2Description: Datasheet; Category: Cap; Lead Free: Yes; Octopart: https://octopart.com/cc0402krx7r7bb104-yageo-42244624; ComponentLink2URL: http://www.yageo.com/documents/recent/UPY-GP_NP0_16V-to-50V_16.pdf; Mouser Description: 0402 0.1 uF 16 V ±10 % Tolerance X7R SMT Multilayer Ceramic Capacitor
C50 C56 = CMP-03422-001118-1: CAP CER 4.7UF 10V X5R 0402; Manufacturer Part Number: CC0402MRX5R6BB475; Manufacturer: YAGEO; Automotive Grade: NA; Tolerance: 0.2; Temperature Coefficient: 30ppm/°C; Material: Ceramic; ComponentLink2URL: http://www.yageo.com/documents/recent/UPY-GP_NP0_16V-to-50V_16.pdf; Temperature Range Low: -55°C; Digikey Description: CAP CER 4.7UF 10V X5R 0402; Category: Cap; Height: 0.55mm; Mouser Description: Multilayer Ceramic Capacitors MLCC - SMD/SMT 4.7M nF X5R 20% 10 Volts; ComponentLink2Description: Datasheet; Automotive: No; Octopart: https://octopart.com/cc0402mrx5r6bb475-yageo-57080755; Device Class L3: Ceramic Capacitors; Temperature Characteristic: X5R; Ipc Land Pattern Name: CAPC10050X50; Device Class L1: Passive Components; RoHS: TRUE; Device Class L2: Capacitors; Temperature Range High: +125°C; Voltage Rating: 10 V; Value: 4.7 uF; Footprint Url: http://www.yageo.com/exep/pages/download/literatures/UPY-C_GEN_24.pdf; Capacitance: 4.7 uF; Package: CC0402; Lead Free: Yes; Temperature: -55°C to +125°C
C112 = CMP-06035-044652-1: Chip Multilayer Ceramic Capacitors for General Purpose, 0402, 10uF, X5R, 15%, 20%, 6.3V
C114 = CMP-06035-003857-1: Chip Multilayer Ceramic Capacitors for General Purpose, 0603, 0.47uF, X7R, 15%, 10%, 25V; Capacitance: 470nF; Voltage: 50V; Case Code (Imperial): 0603; Mount: Surface Mount; Material: Ceramic; Case/Package: 0603; Thickness: 0.035inch; Tolerance: 10%; Length: 1.6mm; Lead Free: Lead Free; Voltage Rating: 25V; Width: 0.031inch; Voltage Rating (DC): 25V; Dielectric: X7R; Case Code (Metric): 1608; Number of Pins: 2; Termination: SMD/SMT; REACH SVHC: No SVHC; Min Operating Temperature: -55°C; Max Operating Temperature: 125°C; Depth: 0.8mm; Height: 0.8mm; Package Quantity: 4000; Packaging: Tape and Reel
R45 = CMP-010-0075-8: Fixed Resistor, Metal Glaze/thick Film, 0.1W, 4700ohm, 75V, 1% +/-Tol, 100ppm/Cel, Surface Mount, 0603; Temperature Coefficient: 100ppm/°C; Case/Package: 0603; Voltage Rating: 75V
R46 R47 = CMP-009-00014-17: 1 kOhms ±1% 0.1W, 1/10W Chip Resistor 0603 (1608 Metric) Moisture Resistant Thick Film; Temperature Coefficient: 100ppm/°C; Voltage Rating: 75V; Case/Package: 0603
R48 = CMP-1011-00438-1: 240R 0.063W 1% 0402 (1005 Metric)  SMD; Case-Metric: 1005; Case-EIA: 0402; Value: 240.00 Ohm; Power: 0.063 W; Tolerance: 1 %; Technology: SMT
U1 = CMP-0364-00030-3: Artix-7 FPGA, 285 User I/Os, 4 GTP, 484-Ball BGA, Speed Grade 2, Industrial Grade, Pb-Free; Manufacturer: Xilinx; DSP48E1 Slices: 240; Speed Grade: -2; Clock Mgmt Tiles (CMTs): 6; Block RAM Blocks (Max Kb): 4860; Max User I/O: 300; Block RAM Blocks (18Kb): 270; CLBs (Slices): 15850; Logic Cells: 101440; Block RAM Blocks (36Kb): 135; ComponentLink2URL: http://www.xilinx.com/support/documentation/user_guides/ug475_7Series_Pkg_Pinout.pdf; DatasheetVersion: v1.12; PartNumber: XC7A100T-2FGG484I; ComponentLink5Description: Packaging and Pinout; PackageDescription: Wire-Bond Fine-Pitch BGA, Body 23 x 23 mm, 1.0 mm Pitch; Mounting Technology: Surface Mount; ComponentLink1Description: Datasheet; ComponentLink4URL: http://www.xilinx.com/support/packagefiles/a7packages/xc7a100tfgg484pkg.txt; PackageVersion: Rev 1.8; NexusDeviceID: XC7A100T-2FGG484I; ComponentLink5URL: http://www.xilinx.com/support/documentation/user_guides/ug475_7Series_Pkg_Pinout.pdf; Code_JEDEC: MS-034-AAJ-1; Generic Part Number: XC7A100T; ComponentLink4Description: Package File; ComponentLink3Description: DC and Switching Characteristics; ComponentLink1URL: http://www.xilinx.com/support/documentation/data_sheets/ds180_7Series_Overview.pdf; CLBs (Max Distributed RAM Kb): 1188; ComponentLink2Description: Package Specification; RoHS: Pb-Free; ComponentLink3URL: http://www.xilinx.com/support/documentation/data_sheets/ds181_Artix_7_Data_Sheet.pdf; PackageReference: FGG484
U7 = MT41K64M16TW-107:J_TR: SDRAM - DDR3L Memory IC 1Gb (64M x 16) Parallel 933MHz 20ns 96-FBGA (8x14); MF: Micron Technology Inc.; MP: MT41K64M16TW-107:J TR; Package: None; Check_prices: https://www.snapeda.com/parts/MT41K64M16TW-107:J%20TR/Micron/view-part/5640273/?ref=eda; Price: None; SnapEDA_Link: https://www.snapeda.com/parts/MT41K64M16TW-107:J%20TR/Micron/view-part/5640273/?ref=snap; Value: *; Purchase-URL: https://pricing.snapeda.com/search/part/MT41K64M16TW-107:J TR/?ref=eda; Availability: Warning
U12 = AP2303MTR-G1: No Description Available; Mfr_Name: Diodes Inc; RefDes: RefDes; Type: Type

## Nets that join several sheets
+1V: FPGA_PD (5 pins), FPGA_DECOUP (R58.1 R60.1)
+1V8: FPGA_PD (C17.1 L.2 R13.2 R16.1), FPGA_DECOUP (R59.1), FPGA_USB (8 pins)
+1V35: FPGA_PD (C20.1 L3.2 R9.1 R18.1), FPGA_DECOUP (6 pins), FPGA_DDR3_Interface (33 pins)
+3V3: FPGA_OUTPUTS (5 pins), FPGA_PD (C13.1 C14.1 L2.2 R10.2), FPGA_ETH (19 pins), FPGA_DECOUP (31 pins), FPGA_USB (26 pins), FPGA_AUDIO (U6.1 U6.9), FPGA_DDR3_Interface (C114.1 U12.6)
+5V: FPGA_PWRIN (11 pins), FPGA_OUTPUTS (J7.5), FPGA_PD (11 pins), FPGA_USB (R37.1), FPGA_AUDIO (U6.25 U6.38)
+VBUS: FPGA_PWRIN (R65.1 U11.1), FPGA_USB (J2.A4-B9 J2.B4-A9)
GND: FPGA_PWRIN (18 pins), FPGA_OUTPUTS (10 pins), FPGA_PD (29 pins), FPGA_ETH (24 pins), FPGA_DECOUP (115 pins), FPGA_USB (56 pins), FPGA_AUDIO (27 pins), FPGA_DDR3_Interface (42 pins)
A0: Sheet1 (U1.H13), FPGA_OUTPUTS (J10.1)
A1: Sheet1 (U1.G15), FPGA_OUTPUTS (J10.2)
A2: Sheet1 (U1.J14), FPGA_OUTPUTS (J10.3)
A3: Sheet1 (U1.J15), FPGA_OUTPUTS (J10.4)
A4: Sheet1 (U1.J22), FPGA_OUTPUTS (J10.5)
A5: Sheet1 (U1.H20), FPGA_OUTPUTS (J10.6)
D8: Sheet1 (U1.AB11), FPGA_OUTPUTS (J9.10)
D9: Sheet1 (U1.AB12), FPGA_OUTPUTS (J9.9)
D10: Sheet1 (U1.AB13), FPGA_OUTPUTS (J9.8)
D11: Sheet1 (U1.AB15), FPGA_OUTPUTS (J9.7)
D12: Sheet1 (U1.AB16), FPGA_OUTPUTS (J9.6)
D13: Sheet1 (U1.AB17), FPGA_OUTPUTS (J9.5)
D14: Sheet1 (U1.AB18), FPGA_OUTPUTS (J9.4)
D15: Sheet1 (U1.AB20), FPGA_OUTPUTS (J9.3)
D16/SDA: Sheet1 (U1.AB21), FPGA_OUTPUTS (J9.2 R74.1)
D17/SCL: Sheet1 (U1.AB22), FPGA_OUTPUTS (J9.1 R73.1)
QSPI_CS: Sheet1 (U1.T19), FPGA_USB (U.1)
QSPI_D0: Sheet1 (U1.P22), FPGA_USB (U.5)
QSPI_D1: Sheet1 (U1.R22), FPGA_USB (U.2)
QSPI_D2: Sheet1 (U1.P21), FPGA_USB (U.3)
QSPI_D3: Sheet1 (U1.R21), FPGA_USB (U.7)
TCK: FPGA_OUTPUTS (P1.6), FPGA_USB (U1.V12 U4.16)
TDI: FPGA_OUTPUTS (P1.10), FPGA_USB (U1.R13 U4.17)
TDO: FPGA_OUTPUTS (P1.8), FPGA_USB (U1.U13 U4.18)
TMS: FPGA_OUTPUTS (P1.4), FPGA_USB (U1.T13 U4.19)